# Altium schematic sheet BQ51013BSCH.SchDoc
size A4
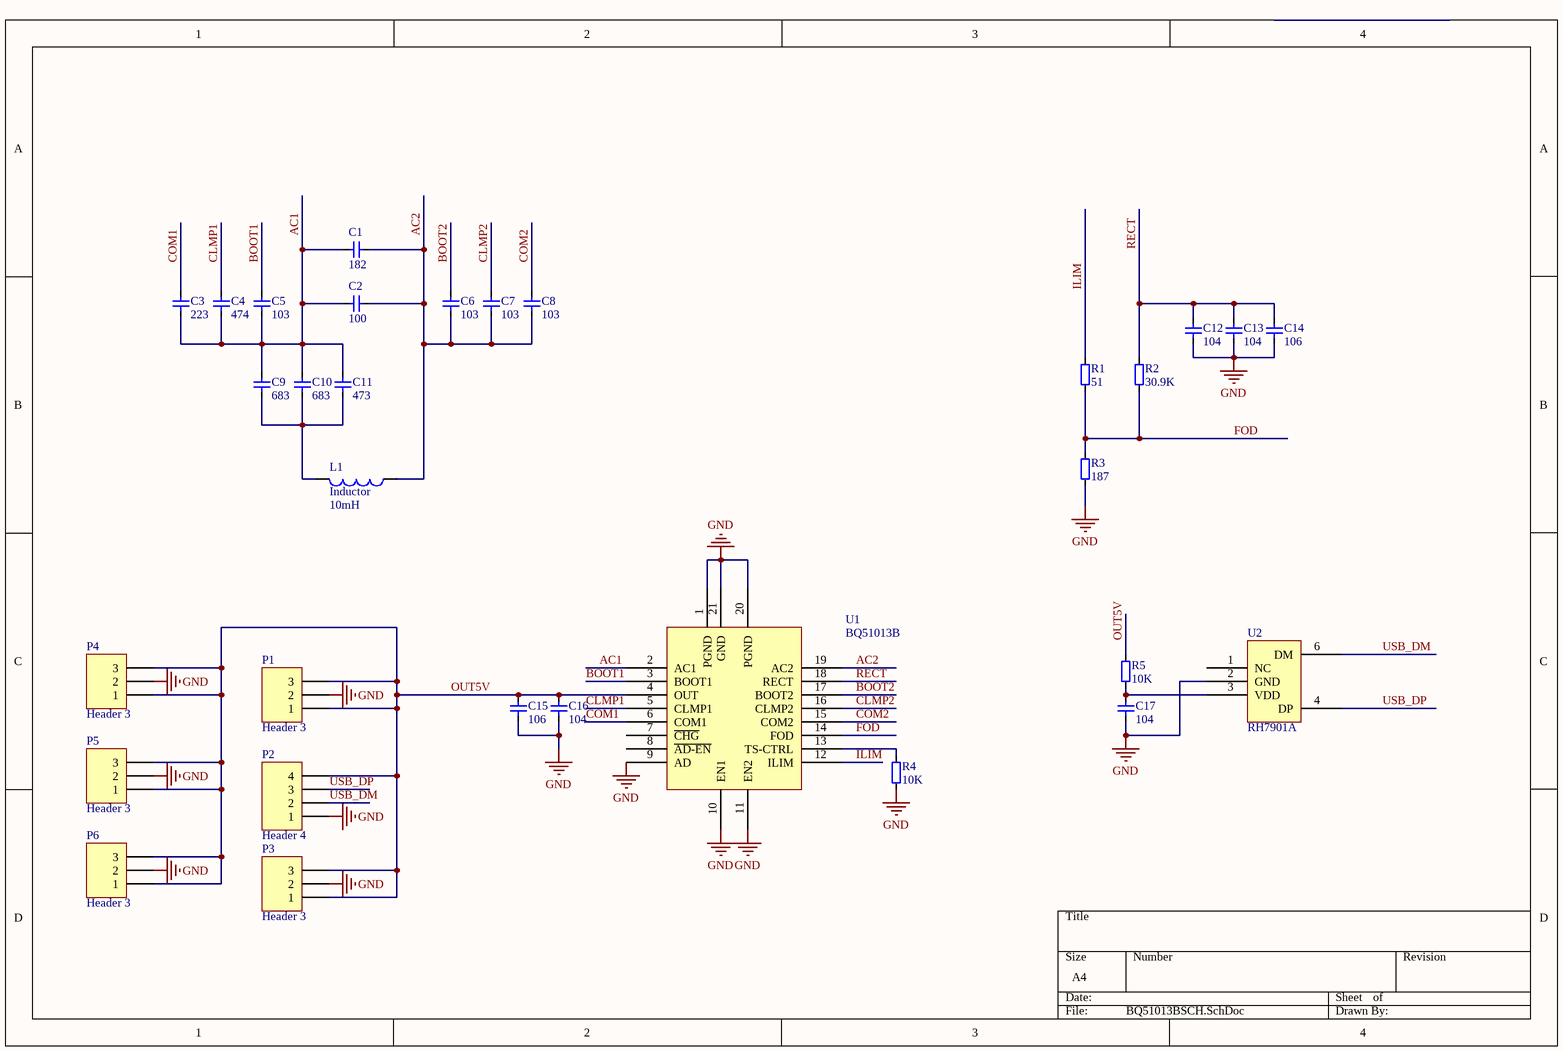
[diagram p0: BQ51013BSCH.SchDoc]

## Parts
C1  182  [RECTANGLE/5.5/7.5/2.5]
C2  100  [RECTANGLE/5.5/7.5/2.5]
C3  223  [0603]
C4  474  [RECTANGLE/5.5/7.5/2.5]
C5  103  [RECTANGLE/5.5/7.5/2.5]
C6  103  [RECTANGLE/5.5/7.5/2.5]
C7  103  [RECTANGLE/5.5/7.5/2.5]
C8  103  [RECTANGLE/5.5/7.5/2.5]
C9  683  [RECTANGLE/5.5/7.5/2.5]
C10  683  [RECTANGLE/5.5/7.5/2.5]
C11  473  [RECTANGLE/5.5/7.5/2.5]
C12  104  [RECTANGLE/5.5/7.5/2.5]
C13  104  [RECTANGLE/5.5/7.5/2.5]
C14  106  [RECTANGLE/5.5/7.5/2.5]
C15  106  [RECTANGLE/5.5/7.5/2.5]
C16  104  [RECTANGLE/5.5/7.5/2.5]
C17  104  [RECTANGLE/5.5/7.5/2.5]
L1  Inductor  value 10mH  [5vinc]
P1  Header 3  [RXConnect]
P2  Header 4  [USB_CONNECT]
P3  Header 3  [RXConnect]
P4  Header 3  [RXConnect]
P5  Header 3  [RXConnect]
P6  Header 3  [RXConnect]
R1  51  [R12.5/2.5]
R2  30.9K  [R12.5/2.5]
R3  187  [R12.5/2.5]
R4  10K  [R12.5/2.5]
R5  10K  [0603]
U1  BQ51013B  [PVQFN-N20]
U2  RH7901A  [SOT23-6_L]

## Nets
GND: C12.1 C13.1 C14.1 C15.2 C16.2 C17.1 P1.2 P2.1 P3.2 P4.2 P5.2 P6.2 R3.1 R4.1 U1.1(PGND) U1.9(AD) U1.10(EN1) U1.11(EN2) U1.20(PGND) U1.21(GND) U2.2(GND)
AC1: C1.1 C2.1 C3.2 C4.2 C5.2 C9.1 C10.1 C11.1 U1.2(AC1)
AC2: C1.2 C2.2 C6.2 C7.2 C8.2 L1.1 U1.19(AC2)
BOOT1: C5.1 U1.3(BOOT1)
BOOT2: C6.1 U1.17(BOOT2)
CLMP1: C4.1 U1.5(CLMP1)
CLMP2: C7.1 U1.16(CLMP2)
COM1: C3.1 U1.6(COM1)
COM2: C8.1 U1.15(COM2)
FOD: R1.1 R2.1 R3.2 U1.14(FOD)
ILIM: R1.2 U1.12(ILIM)
OUT5V: C15.1 C16.1 P1.1 P1.3 P2.4 P3.1 P3.3 P4.1 P4.3 P5.1 P5.3 P6.1 P6.3 R5.2 U1.4(OUT)
RECT: C12.2 C13.2 C14.2 R2.2 U1.18(RECT)
USB_DM: P2.2 U2.6(DM)
USB_DP: P2.3 U2.4(DP)
NetC9_2: C9.2 C10.2 C11.2 L1.2
NetC17_2: C17.2 R5.1 U2.3(VDD)
NetR4_2: R4.2 U1.13(TS-CTRL)

Not connected (* = marked no-connect by the designer): U1 7(~{CHG}) 8(~{AD-EN}); U2 1(NC)

## Library data of the parts
C1-C17 = CAP1: Capacitor
L1 = Inductor: Code_IEC: 1005; Published: 8-Jun-2000; LatestRevisionDate: 29-May-2009; LatestRevisionNote: IPC-7351 Footprint Added.; PackageReference: 0402-A; Publisher: Altium Limited; PackageDescription: Chip Inductor; Code_JEITA: 0402
P1 P3-P6 = Header 3: Header, 3-Pin; LatestRevisionDate: 17-Jul-2002; LatestRevisionNote: Re-released for DXP Platform.; Publisher: Altium Limited
P2 = Header 4: Header, 4-Pin; LatestRevisionDate: 17-Jul-2002; LatestRevisionNote: Re-released for DXP Platform.; Publisher: Altium Limited
R1-R5 = R: 电阻
U2 = RH7901A: RH7019A